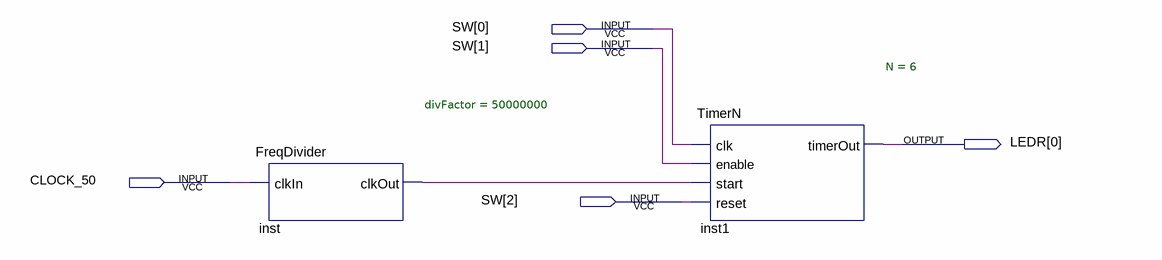
[diagram p0: schematic sheet]
// Quartus schematic TimerN_Demo.bdf as structural Verilog: 2 symbols, 5 pins
module TimerN_Demo (
  input  [2:0] SW,
  input  CLOCK_50,
  output [0:0] LEDR
);

  wire inst_clkout;

  FreqDivider #(.divFactor(50000000)) inst (.clkIn(CLOCK_50), .clkOut(inst_clkout));
  TimerN #(.N(6)) inst1 (.clk(SW[0]), .enable(SW[1]), .start(inst_clkout), .reset(SW[2]), .timerOut(LEDR[0]));
endmodule
